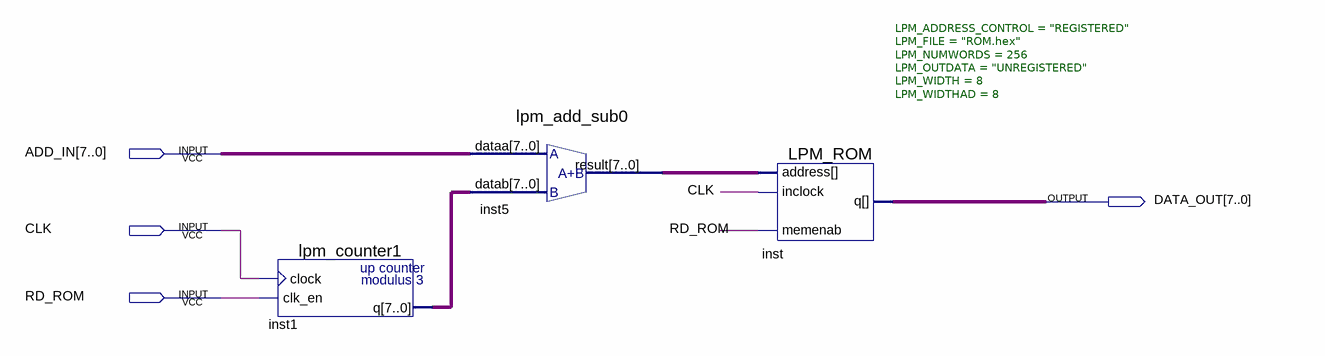
[diagram p0: schematic sheet]
// Quartus schematic ROM.bdf as structural Verilog: 3 symbols, 4 pins
module ROM (
  input  [7:0] ADD_IN,
  input  CLK,
  input  RD_ROM,
  output [7:0] DATA_OUT
);

  wire [7:0] inst1_q, inst5_result;

  lpm_counter1 inst1 (.clock(CLK), .clk_en(RD_ROM), .q(inst1_q));
  lpm_add_sub0 inst5 (.dataa(ADD_IN), .datab(inst1_q), .result(inst5_result));
  LPM_ROM #(.LPM_ADDRESS_CONTROL("REGISTERED"), .LPM_FILE("ROM.hex"), .LPM_NUMWORDS(256), .LPM_OUTDATA("UNREGISTERED"), .LPM_WIDTH(8), .LPM_WIDTHAD(8)) inst (
    .address(inst5_result), .inclock(CLK), .memenab(RD_ROM), .q(DATA_OUT));
endmodule
